# Altium project Orin CAN HAT - Copy.PrjPcb
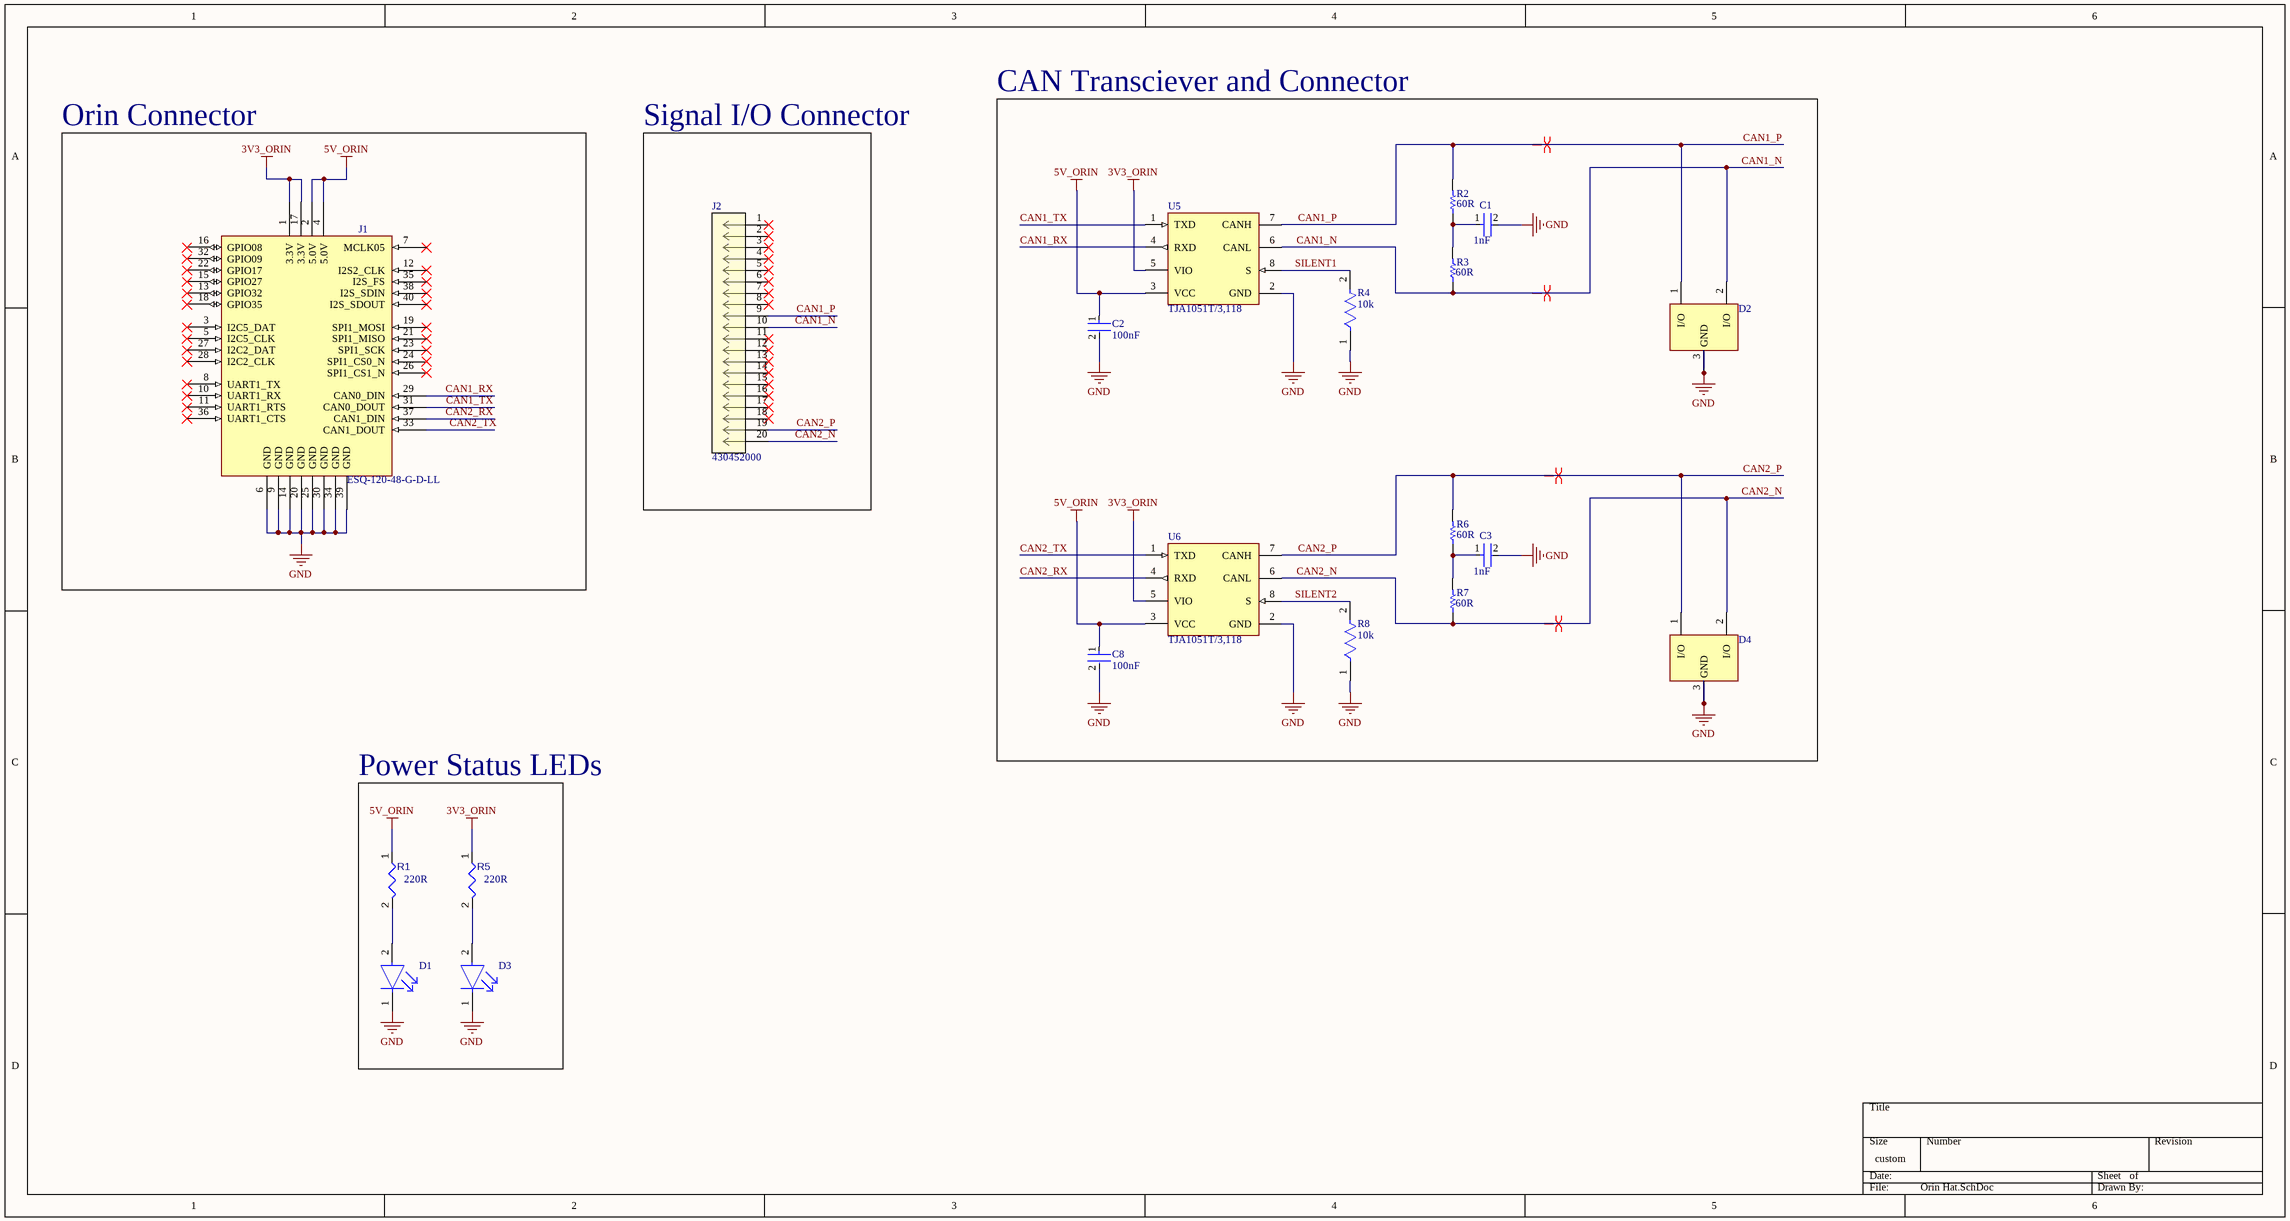
[diagram p0: Orin Hat.SchDoc]
1 sheet, 20 parts. Net scope: global (net labels, ports and power ports of the same name join across sheets).
Board file: Orin PCB.PcbDoc

## Sheet Orin Hat.SchDoc
size 508 x 270 mm; SheetNumber: 1; SheetTotal: 1

### Parts
C1  value 1nF  [FP-C0805C-DN-MFG]  (hidden comment: C0805C102K5RACTU)
C2  value 100nF  [FP-C0603C-CF-IPC_B]  (hidden comment: C0603C104K5RACAUTO)
C3  value 1nF  [FP-C0805C-DN-MFG]  (hidden comment: C0805C102K5RACTU)
C8  value 100nF  [FP-C0603C-CF-IPC_B]  (hidden comment: C0603C104K5RACAUTO)
D1  APT1608ZGCK  [FP-APT1608ZGCK-MFG]  (value not drawn)
D2  ESD2CAN24DCKRQ1  [SOT65P210X110-3N]  (value not drawn)
D3  APT1608ZGCK  [FP-APT1608ZGCK-MFG]  (value not drawn)
D4  ESD2CAN24DCKRQ1  [SOT65P210X110-3N]  (value not drawn)
J1  ESQ-120-48-G-D-LL  [ESQ-120-48-G-D-LL-Footprint-1]
J2  430452000  [CON_430452000_MOL]
R1  value 220R  [RESC2012X06N]  (hidden comment: RC0805JR-7W220RL)
R2  value 60R  [RESC2013X60X35ML10T20]  (hidden comment: RC0805FR-0760R4L)
R3  value 60R  [RESC2013X60X35ML10T20]  (hidden comment: RC0805FR-0760R4L)
R4  Resistance: 10k  [FP-RC0603-0_55-IPC_B]  (hidden comment: RC0603FR-0710KL)
R5  value 220R  [RESC2012X06N]  (hidden comment: RC0805JR-7W220RL)
R6  value 60R  [RESC2013X60X35ML10T20]  (hidden comment: RC0805FR-0760R4L)
R7  value 60R  [RESC2013X60X35ML10T20]  (hidden comment: RC0805FR-0760R4L)
R8  Resistance: 10k  [FP-RC0603-0_55-IPC_B]  (hidden comment: RC0603FR-0710KL)
U5  TJA1051T/3,118  [NXP-SOIC-8_L]
U6  TJA1051T/3,118  [NXP-SOIC-8_L]

### Blocks framed on the sheet
Orin Connector: J1
Signal I/O Connector: J2
CAN Transciever and Connector: C1-C3 C8 D2 D4 R2-R4 R6-R8 U5 U6
Power Status LEDs: D1 D3 R1 R5

### Nets
3V3_ORIN: J1.1(3.3V) J1.17(3.3V) R5.1 U5.5(VIO) U6.5(VIO)
5V_ORIN: C2.1 C8.1 J1.2(5.0V) J1.4(5.0V) R1.1 U5.3(VCC) U6.3(VCC)
GND: C1.2 C2.2 C3.2 C8.2 D1.1(C) D2.3(GND) D3.1(C) D4.3(GND) J1.6(GND) J1.9(GND) J1.14(GND) J1.20(GND) J1.25(GND) J1.30(GND) J1.34(GND) J1.39(GND) R4.1 R8.1 U5.2(GND) U6.2(GND)
CAN1_N: D2.2(I/O) J2.10 R3.1 U5.6(CANL)
CAN1_P: D2.1(I/O) J2.9 R2.2 U5.7(CANH)
CAN1_RX: J1.29(CAN0_DIN) U5.4(RXD)
CAN1_TX: J1.31(CAN0_DOUT) U5.1(TXD)
CAN2_N: D4.2(I/O) J2.20 R7.1 U6.6(CANL)
CAN2_P: D4.1(I/O) J2.19 R6.2 U6.7(CANH)
CAN2_RX: J1.37(CAN1_DIN) U6.4(RXD)
CAN2_TX: J1.33(CAN1_DOUT) U6.1(TXD)
SILENT1: R4.2 U5.8(S)
SILENT2: R8.2 U6.8(S)
NetC1_1: C1.1 R2.1 R3.2
NetC3_1: C3.1 R6.1 R7.2
NetD1_2: D1.2(A) R1.2
NetD3_2: D3.2(A) R5.2

Not connected (* = marked no-connect by the designer): J1 3(I2C5_DAT)* 5(I2C5_CLK)* 7(MCLK05)* 8(UART1_TX)* 10(UART1_RX)* 11(UART1_RTS)* 12(I2S2_CLK)* 13(GPIO32)* 15(GPIO27)* 16(GPIO08)* 18(GPIO35)* 19(SPI1_MOSI)* 21(SPI1_MISO)* 22(GPIO17)* 23(SPI1_SCK)* 24(SPI1_CS0_N)* 26(SPI1_CS1_N)* 27(I2C2_DAT)* 28(I2C2_CLK)* 32(GPIO09)* 35(I2S_FS)* 36(UART1_CTS)* 38(I2S_SDIN)* 40(I2S_SDOUT)*; J2 1* 2* 3* 4* 5* 6* 7* 8* 11* 12* 13* 14* 15* 16* 17* 18*

### Layout directives
differential pair; differential pair class CAN1: CAN1_N, CAN1_P
differential pair; differential pair class CAN2: CAN2_N, CAN2_P

### Library data of the parts
C1 C3 = CMP-2007-01097-2: CAP CER 1000PF 50V X7R 0805; Manufacturer: KEMET; Capacitance: 1,000 pF; Tolerance: 0.1; Temperature Coefficient: 30ppm/°C; Material: Ceramic; Temperature Range High: +125°C; Automotive: No; Device Class L3: Ceramic Capacitors; Category: Cap; Height: 0.88mm; Ipc Land Pattern Name: CAPC200125X78; Mouser Description: Cap Ceramic 0.001uF 50V X7R 10% SMD 0805 125C Plastic T/R; Device Class L1: Passive Components; Lead Free: Yes; Temperature Range Low: -55°C; ComponentLink2URL: https://content.kemet.com/datasheets/KEM_C1003_C0G_SMD.pdf; Octopart: https://octopart.com/c0805c102k5ractu-kemet-93010; Temperature: -55°C to +125°C; Package: C0805C-DN; RoHS: TRUE; Voltage Rating: 50 V; ComponentLink2Description: Datasheet; Digikey Description: CAP CER 1000PF 50V X7R 0805; Device Class L2: Capacitors; Manufacturer Part Number: C0805C102K5RACTU; Temperature Characteristic: X7R
C2 C8 = CMP-2006-03060-2: CAP CER 0.1UF 50V X7R 0603; Manufacturer: KEMET; Tolerance: 0.1; Material: Ceramic; Automotive Grade: Grade 1; Capacitance: 0.10 μF; Temperature Coefficient: 30ppm/°C; RoHS: TRUE; Temperature Range Low: -55°C; Automotive: Yes; Octopart: https://octopart.com/c0603c104k5racauto-kemet-12563741; Temperature Characteristic: X7R; Category: Cap; Voltage Rating: 50 V; Mouser Description: Multilayer Ceramic Capacitors MLCC - SMD/SMT 0.1uF 50volts 10% X7R AUTO; ComponentLink2Description: Datasheet; Device Class L2: Capacitors; Digikey Description: CAP CER 0.1UF 50V X7R 0603; Manufacturer Part Number: C0603C104K5RACAUTO; ComponentLink2URL: https://api.kemet.com/component-edge/download/datasheet/C0603C100J5GACAUTO.pdf; Lead Free: Yes; Height: 0.87mm; Device Class L3: Ceramic Capacitors; Device Class L1: Passive Components; Temperature Range High: +125°C; Package: C0603C-CF; Temperature: -55°C to +125°C
D1 D3 = CMP-44529-000024-1: LED GREEN CLEAR CHIP SMD; Forward Voltage: 3.3V; Dominant Wavelength: 525nm; Forward Current: 20mA; Lens Color: Colorless; Viewing Angle: 120°; Luminous Intensity: 350mcd; Lens Transparency: Clear; Color: Green; Max Operating Temperature: 85°C; Case/Package: 0603; Mount: Surface Mount; Min Operating Temperature: -40°C; Case Code (Metric): 1608; Test Current: 20mA; Packaging: Tape and Reel; Width: 0.8mm; Package Quantity: 1; Height: 0.75mm; Length: 1.6mm; Illumination Color: Green; Lead Free: Lead Free; Case Code (Imperial): 0603
D2 D4 = CMP-004-00032-2: Automotive, dual, 3-pF, ±24-V, ±30-kV ESD protection diode for CAN and in-vehicle networks 3-SC70 -55 to 150
J1 = CMP-002-00083-4: Board Connector, 40 Contact(s), 2 Row(s), Female, Straight, 0.1 inch Pitch, Solder Kinked Leads Terminal, Locking, Black Insulator, Plug
J2 = 430452000: No Description Available; Mfr_Name: Molex Connector Corporation; RefDes: RefDes; Type: Type
R1 R5 = CMP-009-00188-1: General Purpose Chip Resistor Thick Film 0805 220Ohm 5% Paper T/R
R2 R3 R6 R7 = CMP-2001-01223-1: Manufacturer: Yageo; Part Number: RC0805FR-0760R4L
R4 R8 = CMP-2100-03664-2: RES 10K OHM 1% 1/10W 0603; Voltage Rating: 75V; Voltage Rating (DC): 50V; Power Rating: 100mW; Temperature Coefficient: 100ppm/°C; Depth: 0.8mm; Termination: SMD/SMT; Resistor Type: Thick Film; Series: RC; Construction: Rectangular; Features: Moisture Resistant; Packaging: Tape and Reel; Min Operating Temperature: -55°C; Number of Terminations: 2; Lead Pitch: 0.3mm; RoHS Compliant: Yes; Case/Package: 0603; Resistance Tolerance: 1%; Military Standard: Not; Weight: 7.1E-05oz; Number of Pins: 2; Tolerance: 1%; Length: 1.6mm; Case Code (Imperial): 0603; Lead Free: Lead Free; Width: 0.8mm; Max Power Dissipation: 100mW; Height: 0.45mm; Max Operating Temperature: 155°C; Case Code (Metric): 1608; Size Code: 0603
U5 U6 = CMP-2000-07245-1: High-Speed CAN Transceiver, 3 to 5 V, 8-Pin SOIC (SOT96-1), RoHS, Tape and Reel; Manufacturer: NXP; Power Down Mode: Normal/Silent; Rad Hardened: No; Number of Transceivers: 1; Supply Current: 70mA; Operating Supply Voltage (Max): 5.5V; Operating Supply Voltage (Typ): 5V; Operating Supply Voltage (Min): 4.5V; Standard Supported: ISO11898-2; Data Rate: 1Mbps; DELETED: Compliant; Operating Temperature (Min): -40C; Datasheet Version: Rev. 7, 01/2015; Pin Count: 8; Operating Temperature (Max): 125C; Package Description: 8-Pin Small Outline Integrated Circuit, Body 4.9 x 3.9 mm, Pitch 1.27 mm; Category: Transceiver; Packaging: TapeandReel; Mounting: SurfaceMount; Package Reference: SOT96-1; Operating Temperature Classification: Automotive; Mounting Technology: SurfaceMount; Package Type: SO; Manufacturer URL: http://www.nxp.com/; Datasheet URL: http://www.nxp.com/documents/data_sheet/TJA1051.pdf